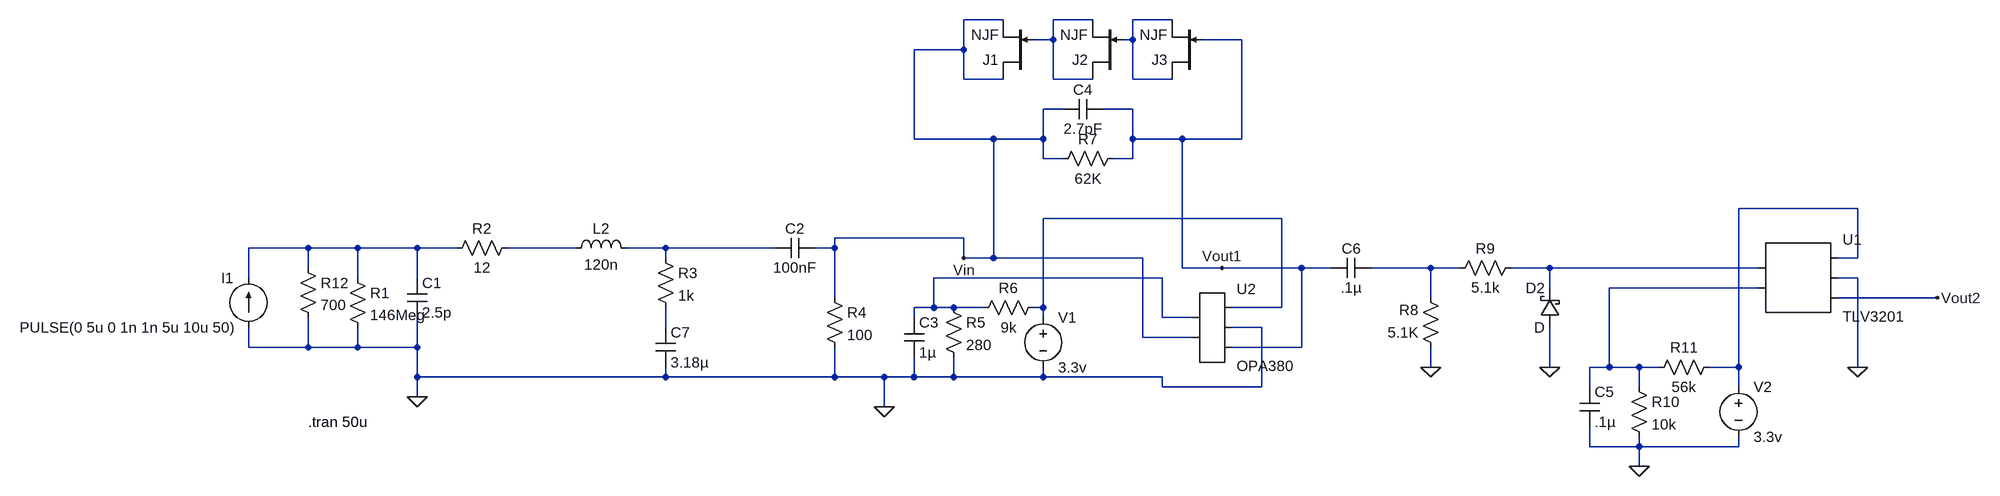
[diagram p0: schematic reciver design 2.asc]
reciver design 2.asc, the LTspice schematic file:
Version 4
SHEET 1 2736 680
WIRE 1152 -144 1088 -144
WIRE 1296 -144 1232 -144
WIRE 1424 -144 1360 -144
WIRE 1232 -112 1232 -144
WIRE 1232 -112 1200 -112
WIRE 1360 -112 1360 -144
WIRE 1360 -112 1344 -112
WIRE 1536 -112 1472 -112
WIRE 1088 -96 1088 -144
WIRE 1088 -96 1008 -96
WIRE 1088 -48 1088 -96
WIRE 1152 -48 1088 -48
WIRE 1232 -48 1232 -112
WIRE 1296 -48 1232 -48
WIRE 1360 -48 1360 -112
WIRE 1424 -48 1360 -48
WIRE 1248 0 1216 0
WIRE 1360 0 1312 0
WIRE 1008 48 1008 -96
WIRE 1136 48 1008 48
WIRE 1216 48 1216 0
WIRE 1216 48 1136 48
WIRE 1360 48 1360 0
WIRE 1440 48 1360 48
WIRE 1536 48 1536 -112
WIRE 1536 48 1440 48
WIRE 1216 80 1216 48
WIRE 1248 80 1216 80
WIRE 1360 80 1360 48
WIRE 1360 80 1328 80
WIRE 2528 160 2336 160
WIRE 1600 176 1216 176
WIRE 1088 208 880 208
WIRE 32 224 -64 224
WIRE 112 224 32 224
WIRE 208 224 112 224
WIRE 272 224 208 224
WIRE 464 224 352 224
WIRE 608 224 544 224
WIRE 784 224 608 224
WIRE 880 224 880 208
WIRE 880 224 848 224
WIRE 608 240 608 224
WIRE 1088 240 1088 208
WIRE 1136 240 1136 48
WIRE 1136 240 1088 240
WIRE 1376 240 1136 240
WIRE 2528 240 2528 160
WIRE 2528 240 2496 240
WIRE 32 256 32 224
WIRE 1440 256 1440 48
WIRE 1504 256 1440 256
WIRE 1632 256 1504 256
WIRE 1680 256 1632 256
WIRE 1840 256 1744 256
WIRE 1888 256 1840 256
WIRE 2032 256 1968 256
WIRE 2368 256 2032 256
WIRE -64 272 -64 224
WIRE 112 272 112 224
WIRE 208 272 208 224
WIRE 1408 272 1040 272
WIRE 2528 272 2496 272
WIRE 2032 288 2032 256
WIRE 2368 288 2128 288
WIRE 880 304 880 224
WIRE 1840 304 1840 256
WIRE 2656 304 2496 304
WIRE 1040 320 1040 272
WIRE 1040 320 1008 320
WIRE 1072 320 1040 320
WIRE 1120 320 1072 320
WIRE 1216 320 1216 176
WIRE 1216 320 1200 320
WIRE 1600 320 1600 176
WIRE 1600 320 1520 320
WIRE 1008 336 1008 320
WIRE 1216 336 1216 320
WIRE 1408 336 1408 272
WIRE 1456 336 1408 336
WIRE 608 352 608 320
WIRE 1568 352 1520 352
WIRE 1376 368 1376 240
WIRE 1456 368 1376 368
WIRE -64 384 -64 352
WIRE 32 384 32 336
WIRE 32 384 -64 384
WIRE 112 384 112 352
WIRE 112 384 32 384
WIRE 208 384 208 336
WIRE 208 384 112 384
WIRE 1632 384 1632 256
WIRE 1632 384 1520 384
WIRE 1840 416 1840 384
WIRE 2032 416 2032 352
WIRE 2128 416 2128 288
WIRE 2128 416 2096 416
WIRE 2176 416 2128 416
WIRE 2208 416 2176 416
WIRE 2336 416 2336 160
WIRE 2336 416 2288 416
WIRE 2528 416 2528 272
WIRE 208 432 208 384
WIRE 608 432 608 416
WIRE 608 432 208 432
WIRE 880 432 880 384
WIRE 880 432 608 432
WIRE 960 432 880 432
WIRE 1008 432 1008 400
WIRE 1008 432 960 432
WIRE 1072 432 1072 400
WIRE 1072 432 1008 432
WIRE 1216 432 1216 416
WIRE 1216 432 1072 432
WIRE 1408 432 1216 432
WIRE 1408 448 1408 432
WIRE 1568 448 1568 352
WIRE 1568 448 1408 448
WIRE 2096 448 2096 416
WIRE 2176 448 2176 416
WIRE 2336 448 2336 416
WIRE 208 464 208 432
WIRE 960 480 960 432
WIRE 2096 544 2096 512
WIRE 2176 544 2176 528
WIRE 2176 544 2096 544
WIRE 2336 544 2336 528
WIRE 2336 544 2176 544
WIRE 2176 576 2176 544
FLAG 208 464 0
FLAG 1504 256 Vout1
FLAG 1088 240 Vin
FLAG 960 480 0
FLAG 1840 416 0
FLAG 2528 416 0
FLAG 2176 576 0
FLAG 2032 416 0
FLAG 2656 304 Vout2
SYMBOL res 96 256 R0
SYMATTR InstName R1
SYMATTR Value 146Meg
SYMBOL cap 192 272 R0
SYMATTR InstName C1
SYMATTR Value 2.5p
SYMBOL res 368 208 R90
WINDOW 0 0 56 VBottom 2
WINDOW 3 32 56 VTop 2
SYMATTR InstName R2
SYMATTR Value 12
SYMBOL current -64 352 R180
WINDOW 3 24 0 Left 2
WINDOW 0 24 80 Left 2
SYMATTR Value PULSE(0 5u 0 1n 1n 5u 10u 50)
SYMATTR InstName I1
SYMATTR Value2 AC .5u 0
SYMBOL Cap 848 208 R90
WINDOW 0 0 32 VBottom 2
WINDOW 3 32 32 VTop 2
SYMATTR InstName C2
SYMATTR Value 100nF
SYMBOL ind 448 240 R270
WINDOW 0 32 56 VTop 2
WINDOW 3 5 56 VBottom 2
SYMATTR InstName L2
SYMATTR Value 120n
SYMBOL Res 864 288 R0
SYMATTR InstName R4
SYMATTR Value 100
SYMBOL Res 1056 304 R0
SYMATTR InstName R5
SYMATTR Value 280
SYMBOL Res 1216 304 R90
WINDOW 0 0 56 VBottom 2
WINDOW 3 32 56 VTop 2
SYMATTR InstName R6
SYMATTR Value 9k
SYMBOL Cap 992 336 R0
SYMATTR InstName C3
SYMATTR Value 1µ
SYMBOL voltage 1216 320 R0
SYMATTR InstName V1
SYMATTR Value 3.3v
SYMBOL Res 1344 64 R90
WINDOW 0 0 56 VBottom 2
WINDOW 3 32 56 VTop 2
SYMATTR InstName R7
SYMATTR Value 62K
SYMBOL Cap 1312 -16 R90
WINDOW 0 0 32 VBottom 2
WINDOW 3 32 32 VTop 2
SYMATTR InstName C4
SYMATTR Value 2.7pF
SYMBOL njf 1200 -48 R180
SYMATTR InstName J1
SYMBOL njf 1344 -48 R180
SYMATTR InstName J2
SYMBOL njf 1472 -48 R180
SYMATTR InstName J3
SYMBOL Res 1856 400 R180
WINDOW 0 36 76 Left 2
WINDOW 3 36 40 Left 2
SYMATTR InstName R8
SYMATTR Value 5.1K
SYMBOL Res 1984 240 R90
WINDOW 0 0 56 VBottom 2
WINDOW 3 32 56 VTop 2
SYMATTR InstName R9
SYMATTR Value 5.1k
SYMBOL schottky 2048 352 R180
WINDOW 0 24 64 Left 2
WINDOW 3 24 0 Left 2
SYMATTR InstName D2
SYMBOL AutoGenerated/TLV3201 2432 272 R0
SYMATTR InstName U1
SYMBOL Cap 2080 448 R0
SYMATTR InstName C5
SYMATTR Value .1µ
SYMBOL Res 2160 432 R0
SYMATTR InstName R10
SYMATTR Value 10k
SYMBOL Voltage 2336 432 R0
SYMATTR InstName V2
SYMATTR Value 3.3v
SYMBOL Res 2304 400 R90
WINDOW 0 0 56 VBottom 2
WINDOW 3 32 56 VTop 2
SYMATTR InstName R11
SYMATTR Value 56k
SYMBOL Cap 1744 240 R90
WINDOW 0 0 32 VBottom 2
WINDOW 3 32 32 VTop 2
SYMATTR InstName C6
SYMATTR Value .1µ
SYMBOL AutoGenerated/OPA380 1488 352 R0
SYMATTR InstName U2
SYMBOL Res 16 240 R0
SYMATTR InstName R12
SYMATTR Value 700
SYMBOL Res 592 224 R0
SYMATTR InstName R3
SYMATTR Value 1k
SYMBOL Cap 592 352 R0
SYMATTR InstName C7
SYMATTR Value 3.18µ
TEXT 32 504 Left 2 !.tran 50u

The netlist it stands for:
* reciver design 2.asc
R1 N005 0 146Meg
C1 N005 0 2.5p
R2 N006 N005 12
I1 0 N005 PULSE(0 5u 0 1n 1n 5u 10u 50) AC .5u 0
C2 Vin N007 100nF
L2 N006 N007 120n
R4 Vin 0 100
R5 N010 0 280
R6 N004 N010 9k
C3 N010 0 1µ
V1 N004 0 3.3v
R7 Vout1 Vin 62K
C4 Vout1 Vin 2.7pF
J1 Vin N001 Vin NJF
J2 N001 N002 N001 NJF
J3 N002 Vout1 N002 NJF
R8 0 N008 5.1K
R9 N009 N008 5.1k
D2 0 N009 D
* U1: TLV3201 (symbol AutoGenerated/TLV3201 not available, pins judged from their places): pin1=N009 pin2=N011 pin3=N003 pin4=0 pin5=Vout2
C5 N011 0 .1µ
R10 N011 0 10k
V2 N003 0 3.3v
R11 N003 N011 56k
C6 N008 Vout1 .1µ
* U2: OPA380 (symbol AutoGenerated/OPA380 not available, pins judged from their places): pin1=N010 pin2=Vin pin3=N004 pin4=0 pin5=Vout1
R12 N005 0 700
R3 N007 N012 1k
C7 N012 0 3.18µ
.model D D
.lib standard.dio
.model NJF NJF
.model PJF PJF
.lib standard.jft
.tran 50u
.backanno
.end